# EAGLE schematic usnoobie (EAGLE 6.2)
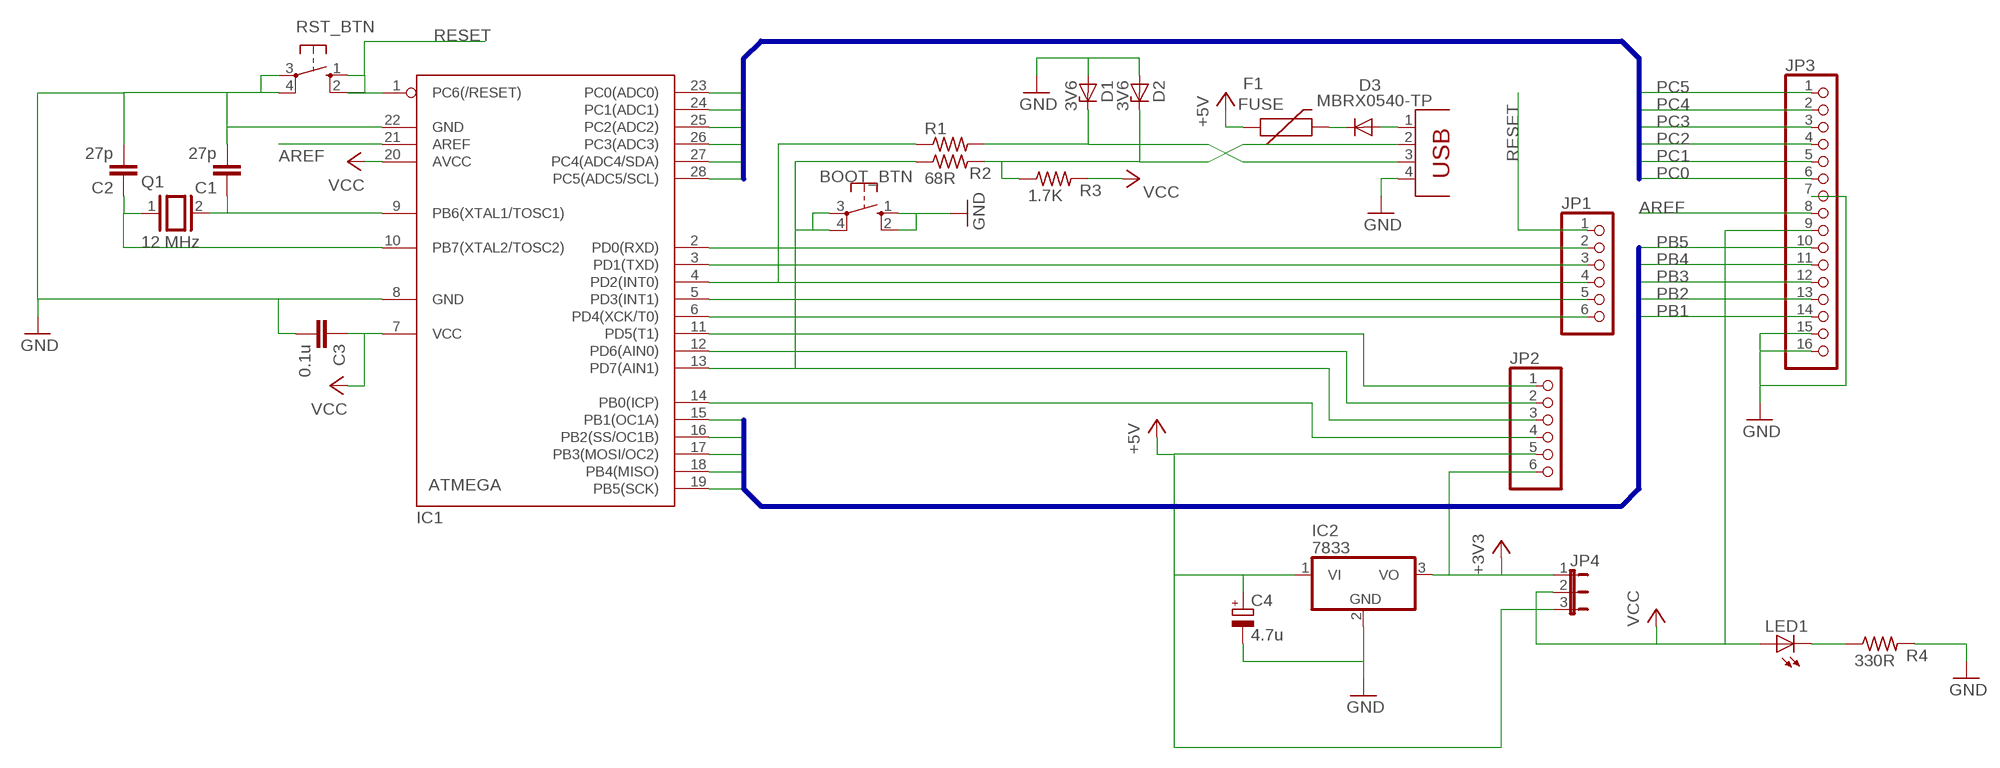
[diagram p0: schematic, sheet 1]

## Parts
BOOT_BTN  10-XX  [B3F-10XX]
C1  27p  C-EU025-025X050  [C025-025X050]
C2  27p  C-EU025-025X050  [C025-025X050]
C3  0.1u  C-EU025-025X050  [C025-025X050]
C4  4.7u  CPOL-EUE5-8.5  [E5-8,5]
D1  3V6  ZENER-DIODEZD-7.5  [ZDIO-7.5]
D2  3V6  ZENER-DIODEZD-7.5  [ZDIO-7.5]
D3  MBRX0540-TP  1N4004  [DO41-10]
F1  FUSE  PTCPTH  [PTC]
IC1  ATMEGA  MEGA8-P  [DIL28-3]
IC2  7833  7805TV  [TO220V]
JP1  PINHD-1X6  [1X06]
JP2  PINHD-1X6  [1X06]
JP3  PINHD-1X16  [1X16]
JP4  JP2E  [JP2]
LED1  LED3MM  [LED3MM]
Q1  12 MHz  XTAL  [Q]
R1  68R  R-US_0204/5  [0204/5]
R2  68R  R-US_0204/5  [0204/5]
R3  1.7K  R-US_0204/5  [0204/5]
R4  330R  R-US_0204/5  [0204/5]
RST_BTN  10-XX  [B3F-10XX]
USB  PN87520  [PN87520]

## Nets
+3V3: IC2.3(VO) JP2.6 JP4.1
+5V: C4.+ F1.P$1 IC2.1(VI) JP2.5 JP4.3
AREF: IC1.21(AREF) JP3.8
GND: BOOT_BTN.1(S) BOOT_BTN.2(S1) C1.2 C2.2 C3.2 C4.- D1.A D2.A IC1.8(GND) IC1.22(GND) IC2.2(GND) JP3.7 JP3.15 JP3.16 R4.2 RST_BTN.3(P) RST_BTN.4(P1) USB.4
N$2: IC1.23(PC0(ADC0))
N$3: IC1.24(PC1(ADC1))
N$4: IC1.25(PC2(ADC2))
N$5: IC1.26(PC3(ADC3))
N$6: IC1.27(PC4(ADC4/SDA))
N$7: IC1.28(PC5(ADC5/SCL))
N$8: LED1.K(C) R4.1
N$14: IC1.2(PD0(RXD)) JP1.2
N$15: IC1.3(PD1(TXD)) JP1.3
N$16: IC1.4(PD2(INT0)) JP1.4 R1.1
N$17: IC1.5(PD3(INT1)) JP1.5
N$18: IC1.6(PD4(XCK/T0)) JP1.6
N$19: IC1.11(PD5(T1)) JP2.1
N$20: IC1.12(PD6(AIN0)) JP2.2
N$21: BOOT_BTN.3(P) BOOT_BTN.4(P1) IC1.13(PD7(AIN1)) JP2.3 R2.1
N$22: IC1.14(PB0(ICP)) JP2.4
N$23: C1.1 IC1.9(PB6(XTAL1/TOSC1)) Q1.2
N$25: D3.A USB.1
N$26: C2.1 Q1.1
N$27: D3.C F1.P$2
N$28: IC1.15(PB1(OC1A))
N$29: IC1.16(PB2(SS/OC1B))
N$31: IC1.17(PB3(MOSI/OC2))
N$32: IC1.18(PB4(MISO))
N$33: IC1.19(PB5(SCK))
N$39: D1.C R1.2 USB.3
N$40: D2.C R2.2 R3.1 USB.2
PB1: JP3.14
PB2: JP3.13
PB3: JP3.12
PB4: JP3.11
PB5: JP3.10
PC0: JP3.6
PC1: JP3.5
PC2: JP3.4
PC3: JP3.3
PC4: JP3.2
PC5: JP3.1
RESET: IC1.1(PC6(/RESET)) JP1.1 RST_BTN.1(S) RST_BTN.2(S1)
VCC: C3.1 IC1.7(VCC) IC1.20(AVCC) JP3.9 JP4.2 LED1.A R3.2
Unconnected: IC1.10(PB7(XTAL2/TOSC2))

## Buses
B$1
B$2

## Library data of the parts
BOOT_BTN RST_BTN = switch-omron-modified:10-XX: OMRON SWITCH
C1-C3 = rcl:C-EU: CAPACITOR, European symbol
C4 = rcl:CPOL-EU: POLARIZED CAPACITOR, European symbol
D1 D2 = diode:ZENER-DIODE: Z-Diode
D3 = diode:1N4004: DIODE general purpose rectifier, 1 A
F1 = SparkFun:PTC: Resettable Fuse PTC Resettable Fuse. Spark Fun Electronics SKU : COM-08357
IC1 = atmel:MEGA8-P: MICROCONTROLLER 8 Kbytes FLASH, 1 kbytes SRAM, 512 bytes EEPROM, USART, 4-channel 10 bit ADC, 2-channel 8 bit ADC Pin compatible with Atmega48, ATMega88, ATMega168 Source: avr.lbr
IC2 = linear:78*: Positive VOLTAGE REGULATOR Source: http://cache.national.com/ds/LM/LM78L05.pdf http://www.fairchildsemi.com/ds/LM/LM7805.pdf
JP1 JP2 = pinhd-modified:PINHD-1X6: PIN HEADER
JP3 = pinhd-modified:PINHD-1X16: PIN HEADER
JP4 = jumper:JP2E: JUMPER
LED1 = led:LED: LED OSRAM: - CHIPLED LG R971, LG N971, LY N971, LG Q971, LY Q971, LO R971, LY R971 LH N974, LH R974 LS Q976, LO Q976, LY Q976 LO Q996 - Hyper CHIPLED LW Q18S LB Q993, LB Q99A, LB R99A - SideLED LS A670, LO A670, LY A670, LG A670, LP A670 LB A673, LV A673, LT A673, LW A673 LH A674 LY A675 LS A676, LA A676, LO A676, LY A676, LW A676 LS A679, LY A679, LG A679 - Hyper Micro SIDELED® LS Y876, LA Y876, LO Y876, LY Y876 LT Y87S - SmartLED LW L88C, LW L88S LB L89C, LB L89S, LG L890 LS L89K, LO L89K, LY L89K LS L896, LA L896, LO L896, LY L896 - TOPLED LS T670, LO T670, LY T670, LG T670, LP T670 LSG T670, LSP T670, LSY T670, LOP T670, LYG T670 LG T671, LOG T671, LSG T671 LB T673, LV T673, LT T673, LW T673 LH T674 LS T676, LA T676, LO T676, LY T676, LB T676, LH T676, LSB T676, LW T676 LB T67C, LV T67C, LT T67C, LS T67K, LO T67K, LY T67K, LW E67C LS E67B, LA E67B, LO E67B, LY E67B, LB E67C, LV E67C, LT E67C LW T67C LS T679, LY T679, LG T679 LS T770, LO T770, LY T770, LG T770, LP T770 LB T773, LV T773, LT T773, LW T773 LH T774 LS E675, LA E675, LY E675, LS T675 LS T776, LA T776, LO T776, LY T776, LB T776 LHGB T686 LT T68C, LB T68C - Hyper Mini TOPLED® LB M676 - Mini TOPLED Santana® LG M470 LS M47K, LO M47K, LY M47K Source: http://www.osram.convergy.de LUXEON: - LUMILED® LXK2-PW12-R00, LXK2-PW12-S00, LXK2-PW14-U00, LXK2-PW14-V00 LXK2-PM12-R00, LXK2-PM12-S00, LXK2-PM14-U00 LXK2-PE12-Q00, LXK2-PE12-R00, LXK2-PE12-S00, LXK2-PE14-T00, LXK2-PE14-U00 LXK2-PB12-K00, LXK2-PB12-L00, LXK2-PB12-M00, LXK2-PB14-N00, LXK2-PB14-P00, LXK2-PB14-Q00 LXK2-PR12-L00, LXK2-PR12-M00, LXK2-PR14-Q00, LXK2-PR14-R00 LXK2-PD12-Q00, LXK2-PD12-R00, LXK2-PD12-S00 LXK2-PH12-R00, LXK2-PH12-S00 LXK2-PL12-P00, LXK2-PL12-Q00, LXK2-PL12-R00 Source: www.luxeon.com KINGBRIGHT: KA-3528ASYC Source: www.kingbright.com
Q1 = special:XTAL: CRYSTAL
R1-R4 = rcl:R-US_: RESISTOR, American symbol
USB = con-berg-nologo:PN87520: BERG USB connector